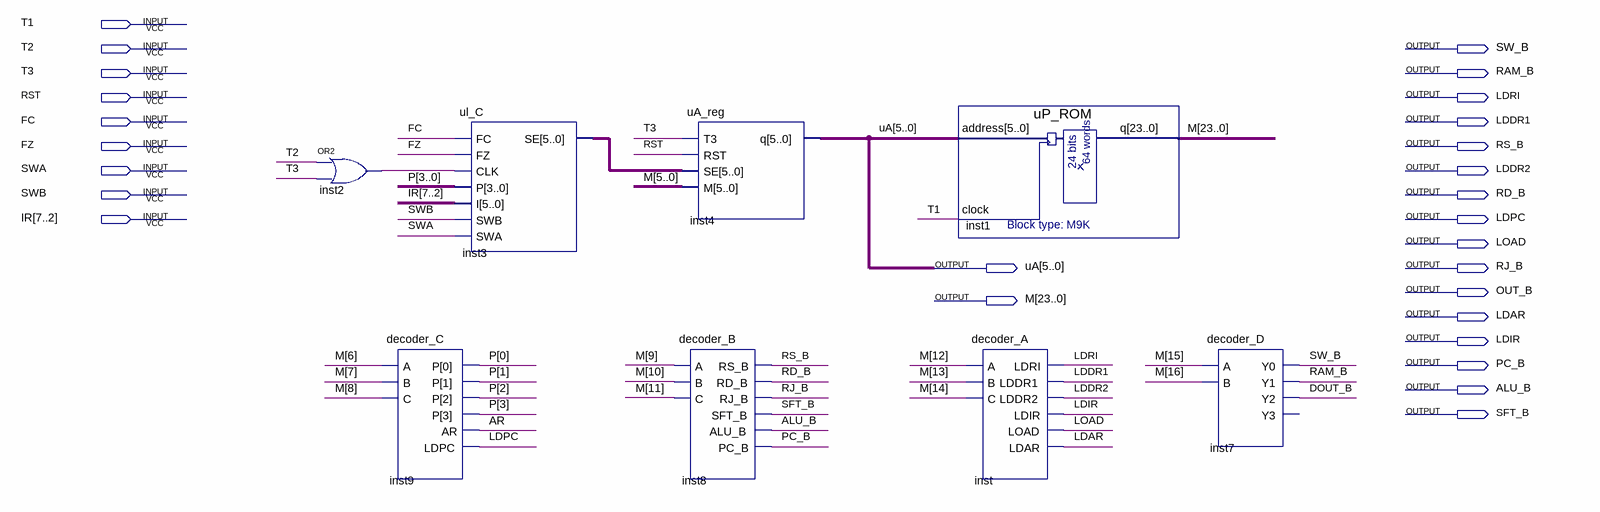
[diagram p0: schematic sheet]
// Quartus schematic uPC.bdf as structural Verilog: 8 symbols, 27 pins
module uPC (
  input  T1,
  input  T2,
  input  T3,
  input  RST,
  input  FC,
  input  FZ,
  input  SWA,
  input  SWB,
  input  [7:2] IR,
  output SW_B,
  output RAM_B,
  output LDRI,
  output LDDR1,
  output RS_B,
  output LDDR2,
  output RD_B,
  output LDPC,
  output LOAD,
  output [5:0] uA,
  output RJ_B,
  output OUT_B,
  output [23:0] M,
  output LDAR,
  output LDIR,
  output PC_B,
  output ALU_B,
  output SFT_B
);

  wire AR, DOUT_B, inst2_out;
  wire [3:0] P;
  wire [5:0] inst3_se;

  or inst2 (inst2_out, T2, T3);
  decoder_C inst9 (.A(M[6]), .B(M[7]), .C(M[8]), .P(P), .AR(AR), .LDPC(LDPC));
  ul_C inst3 (.FC(FC), .FZ(FZ), .CLK(inst2_out), .P(P), .I(IR), .SWB(SWB), .SWA(SWA), .SE(inst3_se));
  uA_reg inst4 (.T3(T3), .RST(RST), .SE(inst3_se), .M(M[5:0]), .q(uA));
  decoder_B inst8 (
    .A(M[9]), .B(M[10]), .C(M[11]), .RS_B(RS_B), .RD_B(RD_B), .RJ_B(RJ_B), .SFT_B(SFT_B), .ALU_B(ALU_B),
    .PC_B(PC_B));
  uP_ROM inst1 (.address(uA), .clock(T1), .q(M));
  decoder_A inst (
    .A(M[12]), .B(M[13]), .C(M[14]), .LDRI(LDRI), .LDDR1(LDDR1), .LDDR2(LDDR2), .LDIR(LDIR), .LOAD(LOAD),
    .LDAR(LDAR));
  decoder_D inst7 (.A(M[15]), .B(M[16]), .Y0(SW_B), .Y1(RAM_B), .Y2(DOUT_B));  // open: Y3
endmodule
